# Altium project FPGA_RGB_LED_Matrix.PrjPcb
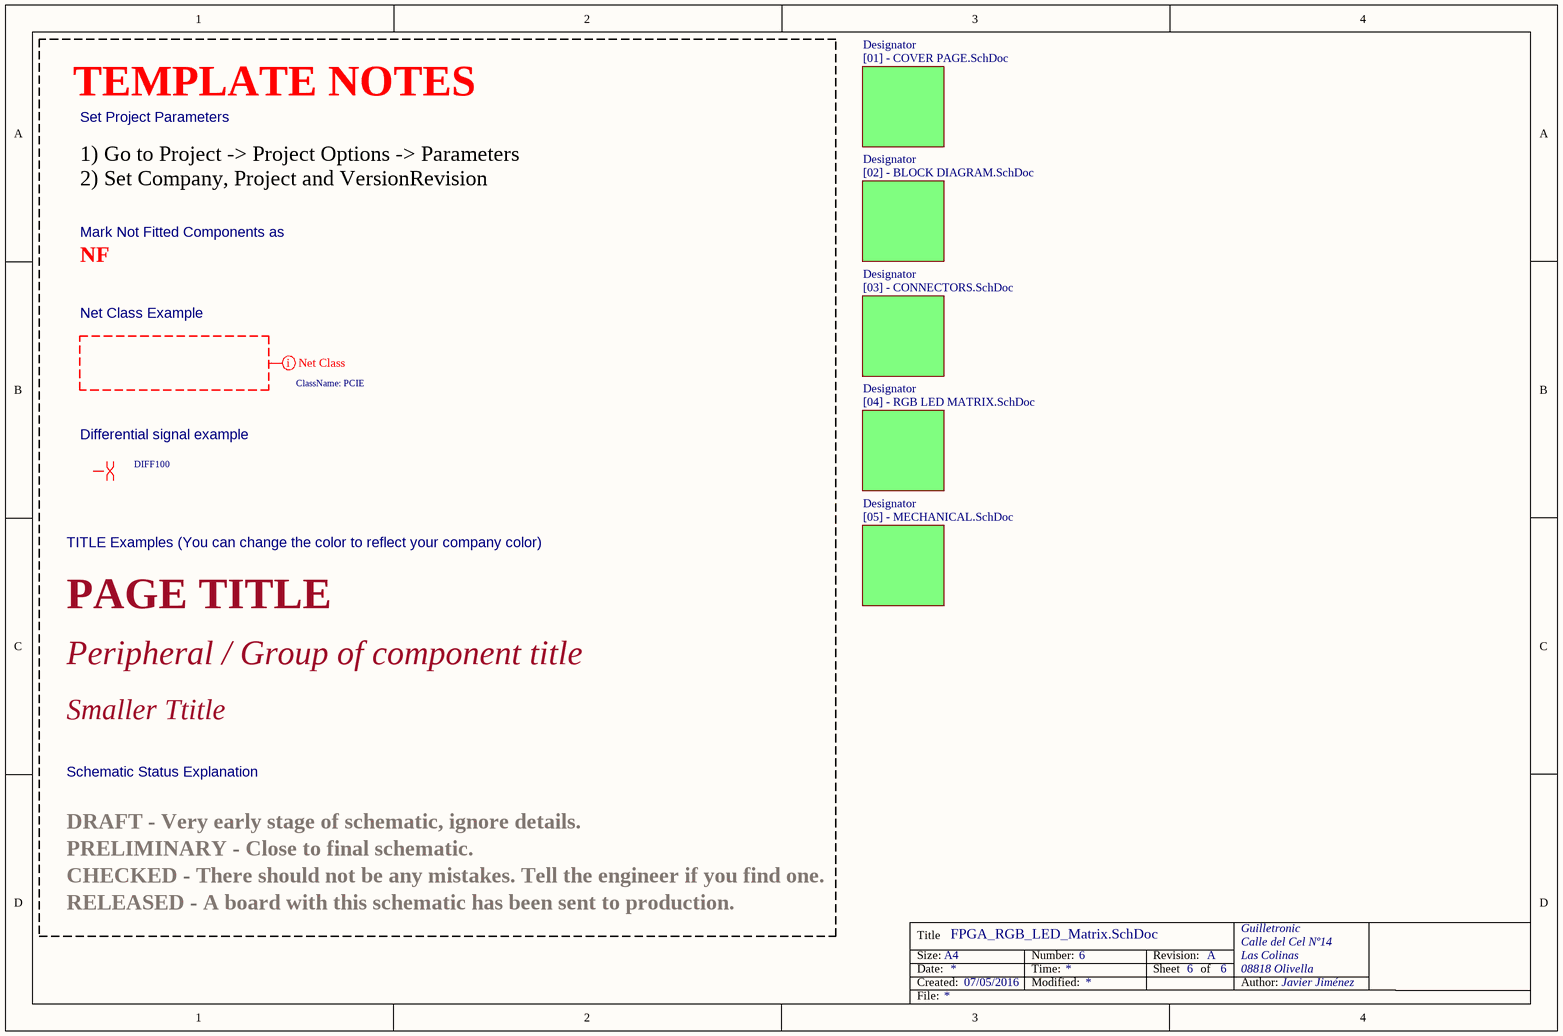
[diagram p0: FPGA_RGB_LED_Matrix.SchDoc]
Project: RGB LED MATRIX; VersionRevision: V1I1
6 sheets, 113 parts. Net scope: global (net labels, ports and power ports of the same name join across sheets).
Board file: RGB_LED MATRIX.PcbDoc
Sheets:
  FPGA_RGB_LED_Matrix.SchDoc
    Designator = [01] - COVER PAGE.SchDoc
    Designator = [02] - BLOCK DIAGRAM.SchDoc
    Designator = [03] - CONNECTORS.SchDoc
    Designator = [04] - RGB LED MATRIX.SchDoc
    Designator = [05] - MECHANICAL.SchDoc

## Sheet FPGA_RGB_LED_Matrix.SchDoc
size A4; Date: 07/05/2016; CheckedBy: Javier Guillemat; Author: Javier Jiménez; CompanyName: Guilletronic; Organization: Guilletronic; Address1: Calle del Cel Nº14; Address2: Las Colinas; Address3: 08818 Olivella; DocumentNumber: 6; Revision: A; SheetNumber: 6; SheetTotal: 6

### Sub-sheets
Designator = [01] - COVER PAGE.SchDoc: no entries
Designator = [02] - BLOCK DIAGRAM.SchDoc: no entries
Designator = [03] - CONNECTORS.SchDoc: no entries
Designator = [04] - RGB LED MATRIX.SchDoc: no entries
Designator = [05] - MECHANICAL.SchDoc: no entries

### Layout directives
net class PCIE: (no net found under the mark)
differential pair; net class DIFF100: (no net found under the mark)

### Notes on the sheet
- TEMPLATE NOTES
- Set Project Parameters
- 1) Go to Project -> Project Options -> Parameters
  2) Set Company, Project and VersionRevision
- Mark Not Fitted Components as
- NF
- Net Class Example
- Differential signal example
- TITLE Examples (You can change the color to reflect your company color)
- PAGE TITLE
- Peripheral / Group of component title
- Schematic Status Explanation
- Smaller Ttitle
- DRAFT - Very early stage of schematic, ignore details.
- PRELIMINARY - Close to final schematic.
- RELEASED - A board with this schematic has been sent to production.
- CHECKED - There should not be any mistakes. Tell the engineer if you find one.
- Title
- Size:
- Date:
- Created:
- A4
- Number:
- Time:
- Modified:
- Revision:
- Sheet
- of
- Author:
- File:

## Sheet [01] - COVER PAGE.SchDoc
size A4; Date: 07/05/2016; CheckedBy: Javier Jiménez Pérez; Author: Javier Jiménez; CompanyName: Guilletronic; Engineer: Javier Jiménez Pérez; Organization: Guilletronic; Address1: Calle del Cel Nº14; Address2: Las Colinas; Address3: 08818 Olivella; DocumentNumber: 1; Revision: A; SheetNumber: 1; SheetTotal: 6
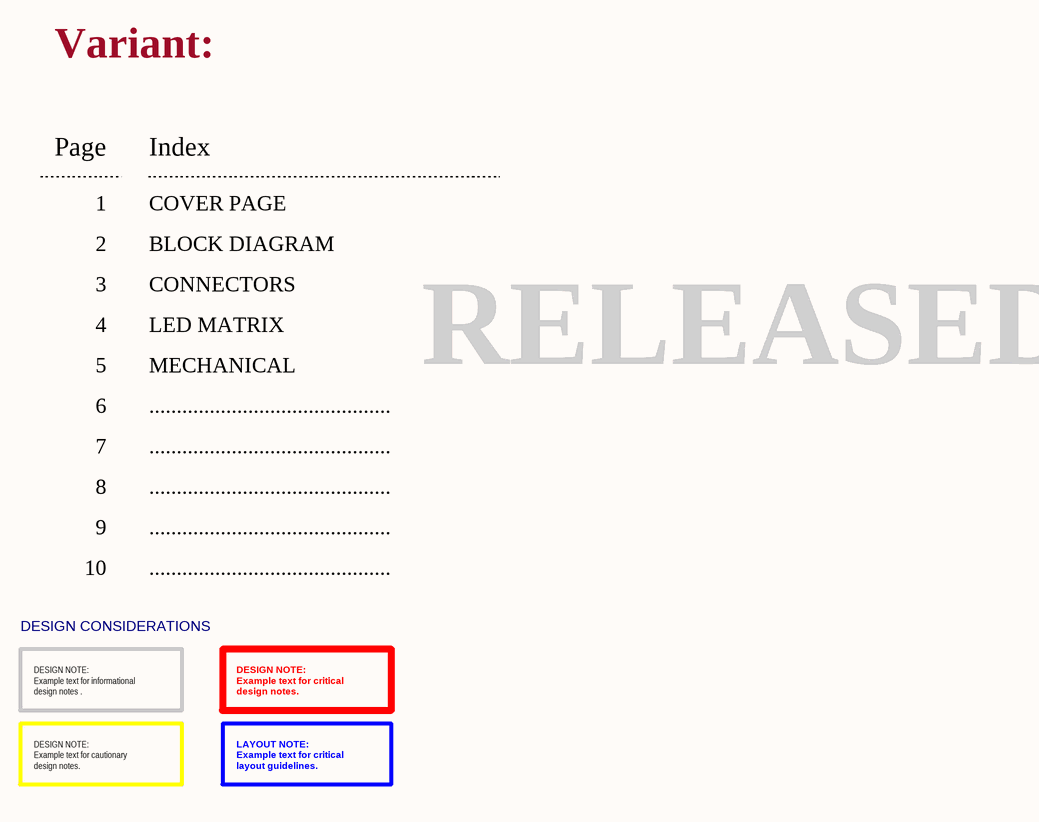
[diagram p1: [01] - COVER PAGE.SchDoc]

### Notes on the sheet
- Variant:
- Page
- Index
- 1
- 2
- COVER PAGE
- BLOCK DIAGRAM
- 3
- 4
- CONNECTORS
- LED MATRIX
- 5
- MECHANICAL
- RELEASED
- 6
- 7
- ............................................
- 8
- 9
- 10
- DESIGN CONSIDERATIONS
- DESIGN NOTE:
  Example text for informational
  design notes .
- DESIGN NOTE:
  Example text for critical
  design notes.
- DESIGN NOTE:
  Example text for cautionary
  design notes.
- LAYOUT NOTE:
  Example text for critical
  layout guidelines.
- Title
- Size:
- Date:
- Created:
- A4
- Number:
- Time:
- Modified:
- Revision:
- Sheet
- of
- Author:
- File:

## Sheet [02] - BLOCK DIAGRAM.SchDoc
size A4; Date: 07/05/2016; CheckedBy: Javier Jiménez Pérez; Author: Javier Jiménez; CompanyName: Guilletronic; Organization: Guilletronic; Address1: Calle del Cel Nº14; Address2: Las Colinas; Address3: 08818 Olivella; DocumentNumber: 2; Revision: A; SheetNumber: 2; SheetTotal: 6
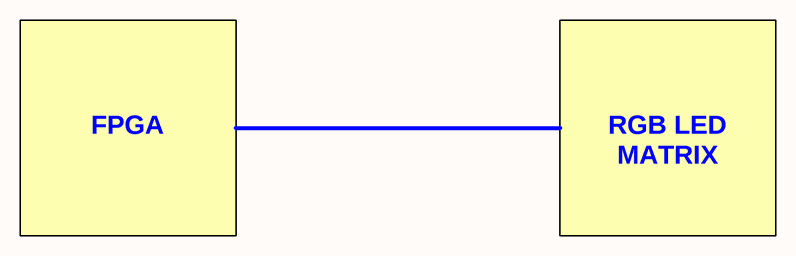
[diagram p2: [02] - BLOCK DIAGRAM.SchDoc]

### Notes on the sheet
- FPGA
- RGB LED MATRIX
- Title
- Size:
- Date:
- Created:
- A4
- Number:
- Time:
- Modified:
- Revision:
- Sheet
- of
- Author:
- File:

## Sheet [03] - CONNECTORS.SchDoc
size A4; Date: 07/05/2016; CheckedBy: Javier Guillemat; Author: Javier Jiménez; CompanyName: Guilletronic; Organization: Guilletronic; Address1: Calle del Cel Nº14; Address2: Las Colinas; Address3: 08818 Olivella; DocumentNumber: 3; Revision: A; SheetNumber: 3; SheetTotal: 6
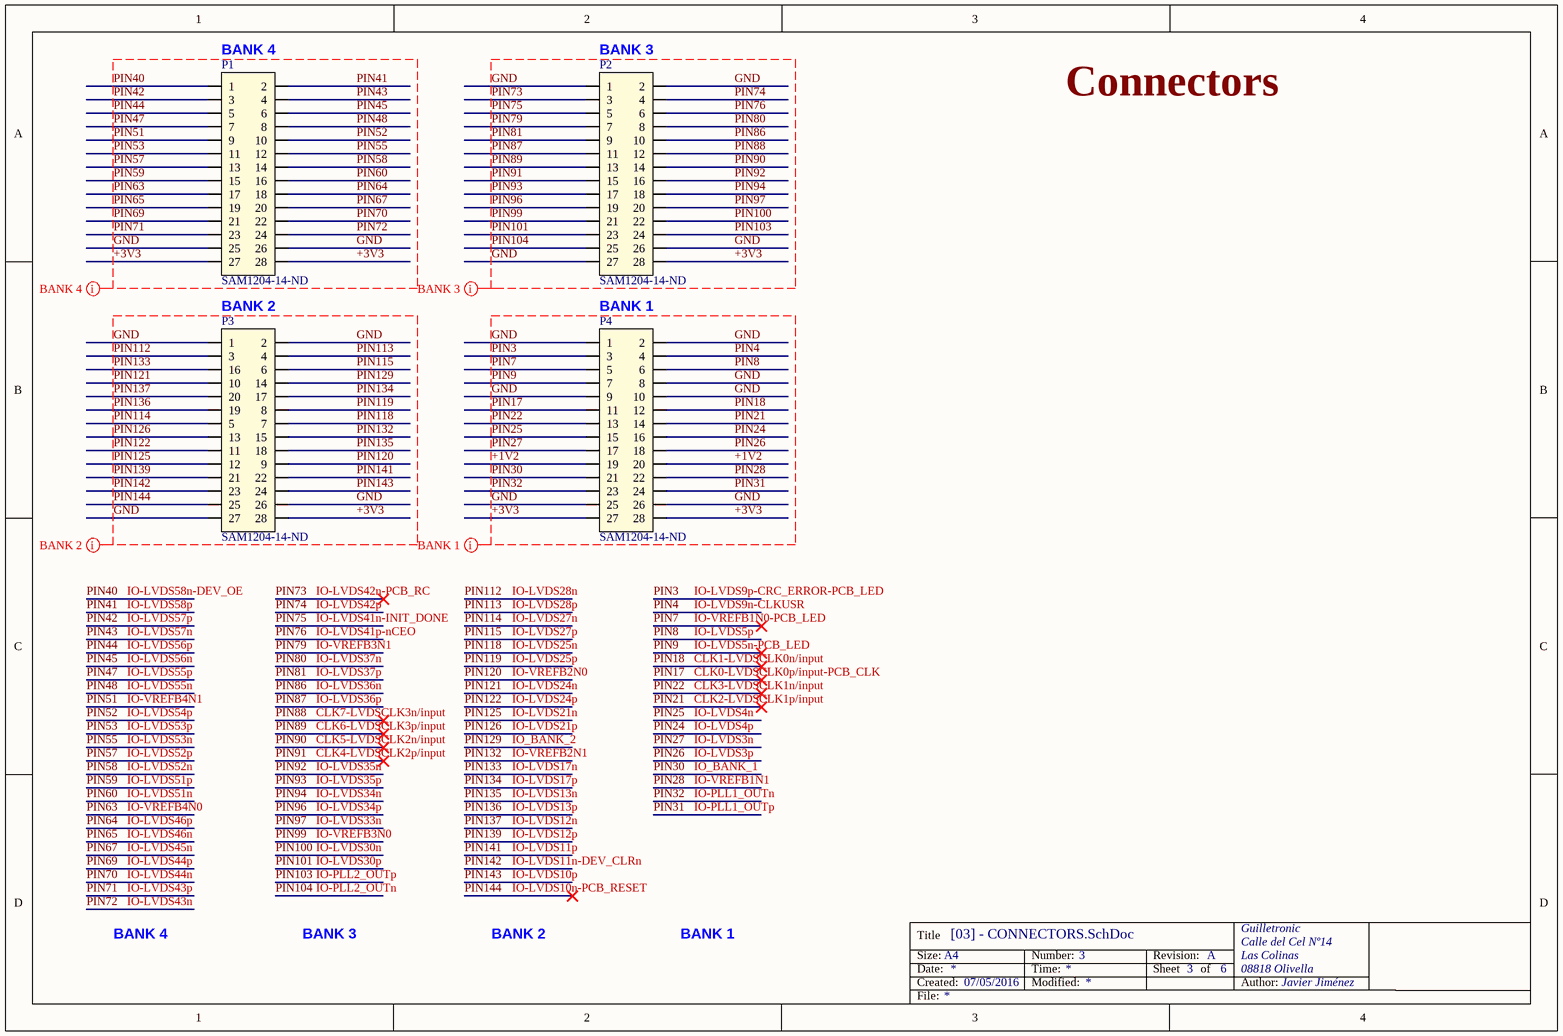
[diagram p3: [03] - CONNECTORS.SchDoc]

### Parts
P1  Supplier Part Number 1: SAM1204-14-ND  [Female Header 14x2 2.54mm 10mm]  (hidden comment: Female Header 14x2 2.54mm 10mm)
P2  Supplier Part Number 1: SAM1204-14-ND  [Female Header 14x2 2.54mm 10mm]  (hidden comment: Female Header 14x2 2.54mm 10mm)
P3  Supplier Part Number 1: SAM1204-14-ND  [Female Header 14x2 2.54mm 10mm]  (hidden comment: Female Header 14x2 2.54mm 10mm)
P4  Supplier Part Number 1: SAM1204-14-ND  [Female Header 14x2 2.54mm 10mm]  (hidden comment: Female Header 14x2 2.54mm 10mm)

### Nets
+1V2: P4.19 P4.20
+3V3: P1.27 P1.28 P2.28 P3.28 P4.27 P4.28
GND: P1.25 P1.26 P2.1 P2.2 P2.26 P2.27 P3.1 P3.2 P3.26 P3.27 P4.1 P4.2 P4.8 P4.9 P4.10 P4.25 P4.26
PIN3: P4.3
PIN4: P4.4
PIN7: P4.5
PIN8: P4.6
PIN9: P4.7
PIN17: P4.11
PIN18: P4.12
PIN21: P4.14
PIN22: P4.13
PIN24: P4.16
PIN25: P4.15
PIN26: P4.18
PIN27: P4.17
PIN28: P4.22
PIN30: P4.21
PIN31: P4.24
PIN32: P4.23
PIN40: P1.1
PIN41: P1.2
PIN42: P1.3
PIN43: P1.4
PIN44: P1.5
PIN45: P1.6
PIN47: P1.7
PIN48: P1.8
PIN51: P1.9
PIN52: P1.10
PIN53: P1.11
PIN55: P1.12
PIN57: P1.13
PIN58: P1.14
PIN59: P1.15
PIN60: P1.16
PIN63: P1.17
PIN64: P1.18
PIN65: P1.19
PIN67: P1.20
PIN69: P1.21
PIN70: P1.22
PIN71: P1.23
PIN72: P1.24
PIN73: P2.3
PIN74: P2.4
PIN75: P2.5
PIN76: P2.6
PIN79: P2.7
PIN80: P2.8
PIN81: P2.9
PIN86: P2.10
PIN87: P2.11
PIN88: P2.12
PIN89: P2.13
PIN90: P2.14
PIN91: P2.15
PIN92: P2.16
PIN93: P2.17
PIN94: P2.18
PIN96: P2.19
PIN97: P2.20
PIN99: P2.21
PIN100: P2.22
PIN101: P2.23
PIN103: P2.24
PIN104: P2.25
PIN112: P3.3
PIN113: P3.4
PIN114: P3.5
PIN115: P3.6
PIN118: P3.7
PIN119: P3.8
PIN120: P3.9
PIN121: P3.10
PIN122: P3.11
PIN125: P3.12
PIN126: P3.13
PIN129: P3.14
PIN132: P3.15
PIN133: P3.16
PIN134: P3.17
PIN135: P3.18
PIN136: P3.19
PIN137: P3.20
PIN139: P3.21
PIN141: P3.22
PIN142: P3.23
PIN143: P3.24
PIN144: P3.25

### Layout directives
net class BANK 2: +3V3, GND, PIN112, PIN113, PIN114, PIN115, PIN118, PIN119, PIN120, PIN121, PIN122, PIN125, PIN126, PIN129, PIN132, PIN133, PIN134, PIN135, PIN136, PIN137, PIN139, PIN141, PIN142, PIN143, PIN144
net class BANK 3: +3V3, GND, PIN73, PIN74, PIN75, PIN76, PIN79, PIN80, PIN81, PIN86, PIN87, PIN88, PIN89, PIN90, PIN91, PIN92, PIN93, PIN94, PIN96, PIN97, PIN99, PIN100, PIN101, PIN103, PIN104
net class BANK 4: +3V3, GND, PIN40, PIN41, PIN42, PIN43, PIN44, PIN45, PIN47, PIN48, PIN51, PIN52, PIN53, PIN55, PIN57, PIN58, PIN59, PIN60, PIN63, PIN64, PIN65, PIN67, PIN69, PIN70, PIN71, PIN72
net class BANK 1: +1V2, +3V3, GND, PIN3, PIN4, PIN7, PIN8, PIN9, PIN17, PIN18, PIN21, PIN22, PIN24, PIN25, PIN26, PIN27, PIN28, PIN30, PIN31, PIN32

### Notes on the sheet
- (near P1) BANK 4
- (near P2) BANK 3
- Connectors
- BANK 2
- BANK 1
- IO-LVDS58n-DEV_OE
- IO-LVDS58p
- IO-LVDS57p
- IO-LVDS57n
- IO-LVDS56p
- IO-LVDS42n-PCB_RC
- IO-LVDS42p
- IO-LVDS41n-INIT_DONE
- IO-LVDS41p-nCEO
- IO-VREFB3N1
- IO-LVDS28n
- IO-LVDS28p
- IO-LVDS27n
- IO-LVDS27p
- IO-LVDS25n
- IO-LVDS9p-CRC_ERROR-PCB_LED
- IO-LVDS9n-CLKUSR
- IO-VREFB1N0-PCB_LED
- IO-LVDS5p
- IO-LVDS5n-PCB_LED
- IO-LVDS56n
- IO-LVDS55p
- IO-LVDS55n
- IO-VREFB4N1
- IO-LVDS54p
- IO-LVDS37n
- IO-LVDS37p
- IO-LVDS36n
- IO-LVDS36p
- CLK7-LVDSCLK3n/input
- IO-LVDS25p
- IO-VREFB2N0
- IO-LVDS24n
- IO-LVDS24p
- IO-LVDS21n
- CLK1-LVDSCLK0n/input
- CLK0-LVDSCLK0p/input-PCB_CLK
- CLK3-LVDSCLK1n/input
- CLK2-LVDSCLK1p/input
- IO-LVDS4n
- IO-LVDS53p
- IO-LVDS53n
- IO-LVDS52p
- IO-LVDS52n
- IO-LVDS51p
- CLK6-LVDSCLK3p/input
- CLK5-LVDSCLK2n/input
- CLK4-LVDSCLK2p/input
- IO-LVDS35n
- IO-LVDS35p
- IO-LVDS21p
- IO_BANK_2
- IO-VREFB2N1
- IO-LVDS17n
- IO-LVDS17p
- IO-LVDS4p
- IO-LVDS3n
- IO-LVDS3p
- IO_BANK_1
- IO-VREFB1N1
- IO-LVDS51n
- IO-VREFB4N0
- IO-LVDS46p
- IO-LVDS46n
- IO-LVDS45n
- IO-LVDS34n
- IO-LVDS34p
- IO-LVDS33n
- IO-VREFB3N0
- IO-LVDS30n
- IO-LVDS13n
- IO-LVDS13p
- IO-LVDS12n
- IO-LVDS12p
- IO-LVDS11p
- IO-PLL1_OUTn
- IO-PLL1_OUTp
- IO-LVDS44p
- IO-LVDS44n
- IO-LVDS43p
- IO-LVDS43n
- IO-LVDS30p
- IO-PLL2_OUTp
- IO-PLL2_OUTn
- IO-LVDS11n-DEV_CLRn
- IO-LVDS10p
- IO-LVDS10n-PCB_RESET
- BANK 4
- BANK 3
- Title
- Size:
- Date:
- Created:
- A4
- Number:
- Time:
- Modified:
- Revision:
- Sheet
- of
- Author:
- File:

### Library data of the parts
P1-P4 = Female Header 14x2 2.54mm 10mm: ELEVATED SOCKET STRIPS; Style: Board to Board; Number of Positions: 14; Number of Positions Loaded: All; Pitch - Mating: 0.100" (2.54mm); Contact Length - Post: 0.090" (2.29mm); Material Flammability Rating: UL94 V-0; Current Rating: 5.7A per Contact; Voltage Rating: 550VAC; Description 2: CONN HEADER FMAL 28PS .1" DL TIN; Category 2: Connectors, Interconnects; RoHS: RoHS Compliant; Packaging: Tube; Part Status: Active; Connector Type: Elevated Socket; Contact Type: Forked; Number of Rows: 2; Row Spacing - Mating: 0.100" (2.54mm); Mounting Type: Through Hole; Termination: Solder; Fastening Type: Push-Pull; Contact Finish - Mating: Gold; Contact Finish Thickness - Mating: 20µin (0.51µm); Insulation Color: Black; Insulation Height: 0.435" (11.05mm); Operating Temperature: -55°C ~ 125°C; Contact Finish - Post: Gold; Mated Stacking Heights: -; Ingress Protection: -; Features: -; Applications: -; Insulation Material: Liquid Crystal Polymer (LCP); Contact Shape: Square; Contact Material: Phosphor Bronze; Contact Finish Thickness - Post: 3µin (0.08µm); ComponentLink1URL: http://suddendocs.samtec.com/prints/esq-1xx-xx-x-x-xxx-xx-x-xx-mkt.pdf; ComponentLink1Description: http://suddendocs.samtec.com/prints/esq-1xx-xx-x-x-xxx-xx-x-xx-mkt.pdf; ComponentLink2URL: http://www.sullinscorp.com/drawings/78_P(N)PxCxxxLFBN-RC,_10492-H.pdf; ComponentLink2Description: http://www.sullinscorp.com/drawings/78_P(N)PxCxxxLFBN-RC,_10492-H.pdf; Supplier 1: Digi-Key; Manufacturer 2: Sullins Connector Solutions; Manufacturer Part Number 2: PPTC142LFBN-RC; Stock 2: 1937; Pricing 2: 1=1.92, 10=1.586, 25=1.4868, 50=1.3216, 100=1.1894, 250=1.09692, 500=0.9912, 1000=0.87886, 2500=0.84252 (EUR)

## Sheet [04] - RGB LED MATRIX.SchDoc
size A4; Date: 07/05/2016; CheckedBy: Javier Guillemat; Author: Javier Jiménez; CompanyName: Guilletronic; Organization: Guilletronic; Address1: Calle del Cel Nº14; Address2: Las Colinas; Address3: 08818 Olivella; DocumentNumber: 4; Revision: A; SheetNumber: 4; SheetTotal: 6
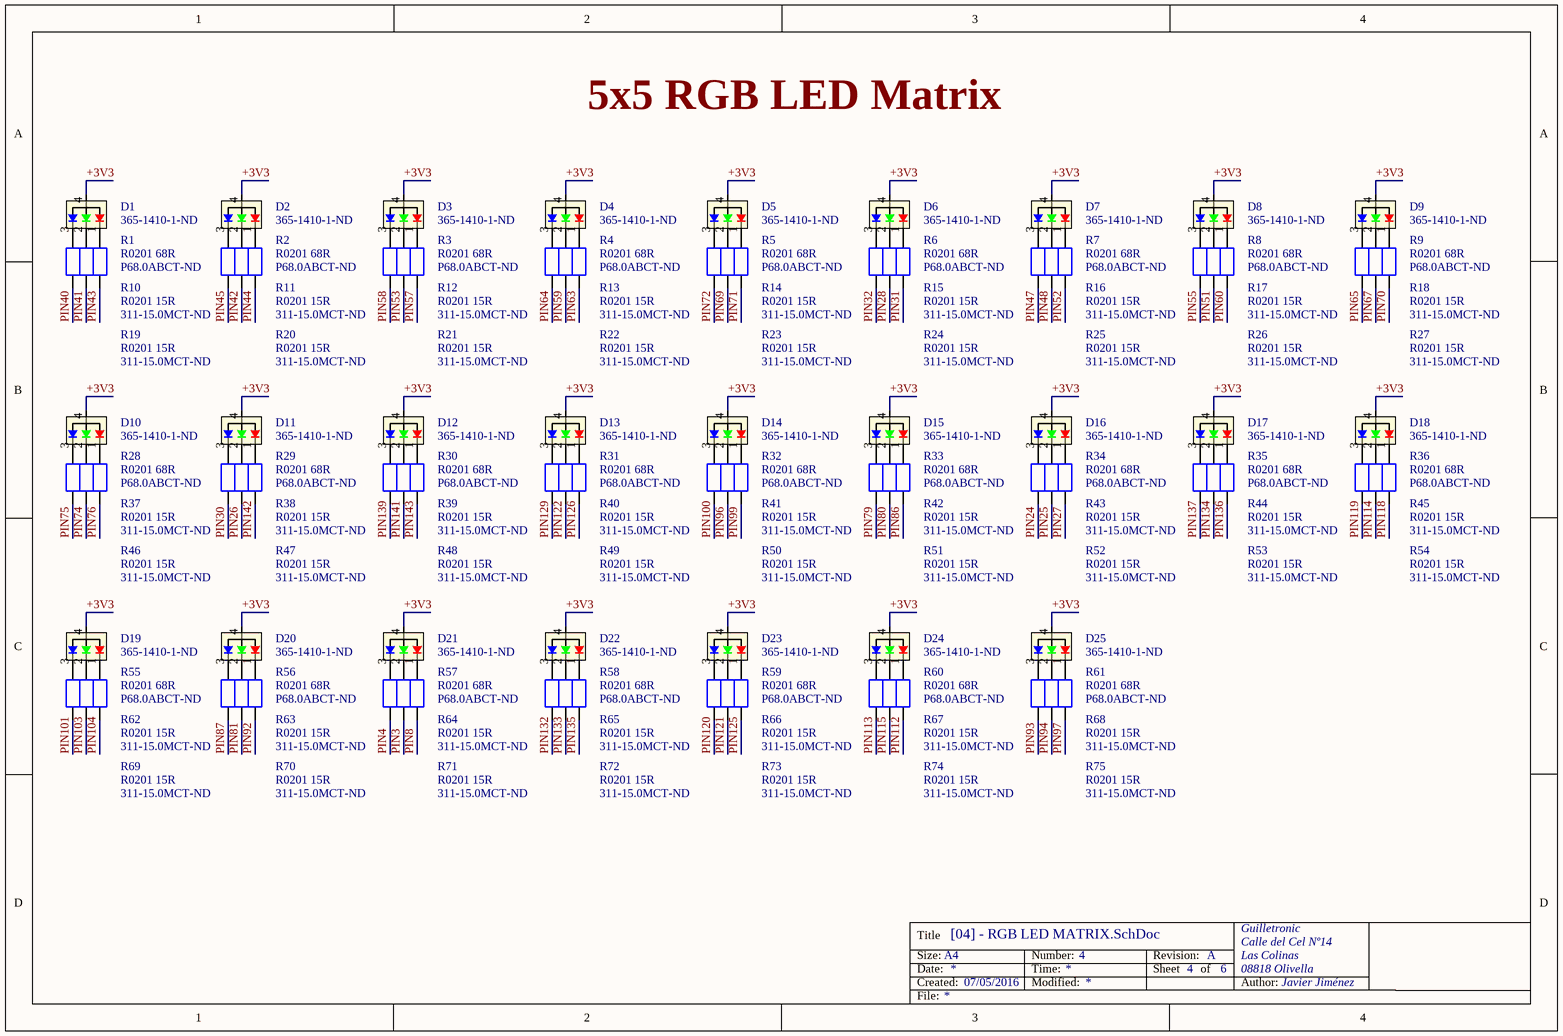
[diagram p4: [04] - RGB LED MATRIX.SchDoc]

### Parts
D1  Supplier Part Number 1: 365-1410-1-ND  [LED RGB]  (hidden comment: LED RGB)
D2  Supplier Part Number 1: 365-1410-1-ND  [LED RGB]  (hidden comment: LED RGB)
D3  Supplier Part Number 1: 365-1410-1-ND  [LED RGB]  (hidden comment: LED RGB)
D4  Supplier Part Number 1: 365-1410-1-ND  [LED RGB]  (hidden comment: LED RGB)
D5  Supplier Part Number 1: 365-1410-1-ND  [LED RGB]  (hidden comment: LED RGB)
D6  Supplier Part Number 1: 365-1410-1-ND  [LED RGB]  (hidden comment: LED RGB)
D7  Supplier Part Number 1: 365-1410-1-ND  [LED RGB]  (hidden comment: LED RGB)
D8  Supplier Part Number 1: 365-1410-1-ND  [LED RGB]  (hidden comment: LED RGB)
D9  Supplier Part Number 1: 365-1410-1-ND  [LED RGB]  (hidden comment: LED RGB)
D10  Supplier Part Number 1: 365-1410-1-ND  [LED RGB]  (hidden comment: LED RGB)
D11  Supplier Part Number 1: 365-1410-1-ND  [LED RGB]  (hidden comment: LED RGB)
D12  Supplier Part Number 1: 365-1410-1-ND  [LED RGB]  (hidden comment: LED RGB)
D13  Supplier Part Number 1: 365-1410-1-ND  [LED RGB]  (hidden comment: LED RGB)
D14  Supplier Part Number 1: 365-1410-1-ND  [LED RGB]  (hidden comment: LED RGB)
D15  Supplier Part Number 1: 365-1410-1-ND  [LED RGB]  (hidden comment: LED RGB)
D16  Supplier Part Number 1: 365-1410-1-ND  [LED RGB]  (hidden comment: LED RGB)
D17  Supplier Part Number 1: 365-1410-1-ND  [LED RGB]  (hidden comment: LED RGB)
D18  Supplier Part Number 1: 365-1410-1-ND  [LED RGB]  (hidden comment: LED RGB)
D19  Supplier Part Number 1: 365-1410-1-ND  [LED RGB]  (hidden comment: LED RGB)
D20  Supplier Part Number 1: 365-1410-1-ND  [LED RGB]  (hidden comment: LED RGB)
D21  Supplier Part Number 1: 365-1410-1-ND  [LED RGB]  (hidden comment: LED RGB)
D22  Supplier Part Number 1: 365-1410-1-ND  [LED RGB]  (hidden comment: LED RGB)
D23  Supplier Part Number 1: 365-1410-1-ND  [LED RGB]  (hidden comment: LED RGB)
D24  Supplier Part Number 1: 365-1410-1-ND  [LED RGB]  (hidden comment: LED RGB)
D25  Supplier Part Number 1: 365-1410-1-ND  [LED RGB]  (hidden comment: LED RGB)
R1  R0201 68R  Supplier Part Number 1: P68.0ABCT-ND  [R0201]
R2  R0201 68R  Supplier Part Number 1: P68.0ABCT-ND  [R0201]
R3  R0201 68R  Supplier Part Number 1: P68.0ABCT-ND  [R0201]
R4  R0201 68R  Supplier Part Number 1: P68.0ABCT-ND  [R0201]
R5  R0201 68R  Supplier Part Number 1: P68.0ABCT-ND  [R0201]
R6  R0201 68R  Supplier Part Number 1: P68.0ABCT-ND  [R0201]
R7  R0201 68R  Supplier Part Number 1: P68.0ABCT-ND  [R0201]
R8  R0201 68R  Supplier Part Number 1: P68.0ABCT-ND  [R0201]
R9  R0201 68R  Supplier Part Number 1: P68.0ABCT-ND  [R0201]
R10  R0201 15R  Supplier Part Number 1: 311-15.0MCT-ND  [R0201]
R11  R0201 15R  Supplier Part Number 1: 311-15.0MCT-ND  [R0201]
R12  R0201 15R  Supplier Part Number 1: 311-15.0MCT-ND  [R0201]
R13  R0201 15R  Supplier Part Number 1: 311-15.0MCT-ND  [R0201]
R14  R0201 15R  Supplier Part Number 1: 311-15.0MCT-ND  [R0201]
R15  R0201 15R  Supplier Part Number 1: 311-15.0MCT-ND  [R0201]
R16  R0201 15R  Supplier Part Number 1: 311-15.0MCT-ND  [R0201]
R17  R0201 15R  Supplier Part Number 1: 311-15.0MCT-ND  [R0201]
R18  R0201 15R  Supplier Part Number 1: 311-15.0MCT-ND  [R0201]
R19  R0201 15R  Supplier Part Number 1: 311-15.0MCT-ND  [R0201]
R20  R0201 15R  Supplier Part Number 1: 311-15.0MCT-ND  [R0201]
R21  R0201 15R  Supplier Part Number 1: 311-15.0MCT-ND  [R0201]
R22  R0201 15R  Supplier Part Number 1: 311-15.0MCT-ND  [R0201]
R23  R0201 15R  Supplier Part Number 1: 311-15.0MCT-ND  [R0201]
R24  R0201 15R  Supplier Part Number 1: 311-15.0MCT-ND  [R0201]
R25  R0201 15R  Supplier Part Number 1: 311-15.0MCT-ND  [R0201]
R26  R0201 15R  Supplier Part Number 1: 311-15.0MCT-ND  [R0201]
R27  R0201 15R  Supplier Part Number 1: 311-15.0MCT-ND  [R0201]
R28  R0201 68R  Supplier Part Number 1: P68.0ABCT-ND  [R0201]
R29  R0201 68R  Supplier Part Number 1: P68.0ABCT-ND  [R0201]
R30  R0201 68R  Supplier Part Number 1: P68.0ABCT-ND  [R0201]
R31  R0201 68R  Supplier Part Number 1: P68.0ABCT-ND  [R0201]
R32  R0201 68R  Supplier Part Number 1: P68.0ABCT-ND  [R0201]
R33  R0201 68R  Supplier Part Number 1: P68.0ABCT-ND  [R0201]
R34  R0201 68R  Supplier Part Number 1: P68.0ABCT-ND  [R0201]
R35  R0201 68R  Supplier Part Number 1: P68.0ABCT-ND  [R0201]
R36  R0201 68R  Supplier Part Number 1: P68.0ABCT-ND  [R0201]
R37  R0201 15R  Supplier Part Number 1: 311-15.0MCT-ND  [R0201]
R38  R0201 15R  Supplier Part Number 1: 311-15.0MCT-ND  [R0201]
R39  R0201 15R  Supplier Part Number 1: 311-15.0MCT-ND  [R0201]
R40  R0201 15R  Supplier Part Number 1: 311-15.0MCT-ND  [R0201]
R41  R0201 15R  Supplier Part Number 1: 311-15.0MCT-ND  [R0201]
R42  R0201 15R  Supplier Part Number 1: 311-15.0MCT-ND  [R0201]
R43  R0201 15R  Supplier Part Number 1: 311-15.0MCT-ND  [R0201]
R44  R0201 15R  Supplier Part Number 1: 311-15.0MCT-ND  [R0201]
R45  R0201 15R  Supplier Part Number 1: 311-15.0MCT-ND  [R0201]
R46  R0201 15R  Supplier Part Number 1: 311-15.0MCT-ND  [R0201]
R47  R0201 15R  Supplier Part Number 1: 311-15.0MCT-ND  [R0201]
R48  R0201 15R  Supplier Part Number 1: 311-15.0MCT-ND  [R0201]
R49  R0201 15R  Supplier Part Number 1: 311-15.0MCT-ND  [R0201]
R50  R0201 15R  Supplier Part Number 1: 311-15.0MCT-ND  [R0201]
R51  R0201 15R  Supplier Part Number 1: 311-15.0MCT-ND  [R0201]
R52  R0201 15R  Supplier Part Number 1: 311-15.0MCT-ND  [R0201]
R53  R0201 15R  Supplier Part Number 1: 311-15.0MCT-ND  [R0201]
R54  R0201 15R  Supplier Part Number 1: 311-15.0MCT-ND  [R0201]
R55  R0201 68R  Supplier Part Number 1: P68.0ABCT-ND  [R0201]
R56  R0201 68R  Supplier Part Number 1: P68.0ABCT-ND  [R0201]
R57  R0201 68R  Supplier Part Number 1: P68.0ABCT-ND  [R0201]
R58  R0201 68R  Supplier Part Number 1: P68.0ABCT-ND  [R0201]
R59  R0201 68R  Supplier Part Number 1: P68.0ABCT-ND  [R0201]
R60  R0201 68R  Supplier Part Number 1: P68.0ABCT-ND  [R0201]
R61  R0201 68R  Supplier Part Number 1: P68.0ABCT-ND  [R0201]
R62  R0201 15R  Supplier Part Number 1: 311-15.0MCT-ND  [R0201]
R63  R0201 15R  Supplier Part Number 1: 311-15.0MCT-ND  [R0201]
R64  R0201 15R  Supplier Part Number 1: 311-15.0MCT-ND  [R0201]
R65  R0201 15R  Supplier Part Number 1: 311-15.0MCT-ND  [R0201]
R66  R0201 15R  Supplier Part Number 1: 311-15.0MCT-ND  [R0201]
R67  R0201 15R  Supplier Part Number 1: 311-15.0MCT-ND  [R0201]
R68  R0201 15R  Supplier Part Number 1: 311-15.0MCT-ND  [R0201]
R69  R0201 15R  Supplier Part Number 1: 311-15.0MCT-ND  [R0201]
R70  R0201 15R  Supplier Part Number 1: 311-15.0MCT-ND  [R0201]
R71  R0201 15R  Supplier Part Number 1: 311-15.0MCT-ND  [R0201]
R72  R0201 15R  Supplier Part Number 1: 311-15.0MCT-ND  [R0201]
R73  R0201 15R  Supplier Part Number 1: 311-15.0MCT-ND  [R0201]
R74  R0201 15R  Supplier Part Number 1: 311-15.0MCT-ND  [R0201]
R75  R0201 15R  Supplier Part Number 1: 311-15.0MCT-ND  [R0201]

### Nets
+3V3: D1.4(ANODE) D2.4(ANODE) D3.4(ANODE) D4.4(ANODE) D5.4(ANODE) D6.4(ANODE) D7.4(ANODE) D8.4(ANODE) D9.4(ANODE) D10.4(ANODE) D11.4(ANODE) D12.4(ANODE) D13.4(ANODE) D14.4(ANODE) D15.4(ANODE) D16.4(ANODE) D17.4(ANODE) D18.4(ANODE) D19.4(ANODE) D20.4(ANODE) D21.4(ANODE) D22.4(ANODE) D23.4(ANODE) D24.4(ANODE) D25.4(ANODE)
PIN3: R64.2
PIN4: R71.2
PIN8: R57.2
PIN24: R52.2
PIN25: R43.2
PIN26: R38.2
PIN27: R34.2
PIN28: R15.2
PIN30: R47.2
PIN31: R6.2
PIN32: R24.2
PIN40: R19.2
PIN41: R10.2
PIN42: R11.2
PIN43: R1.2
PIN44: R2.2
PIN45: R20.2
PIN47: R25.2
PIN48: R16.2
PIN51: R17.2
PIN52: R7.2
PIN53: R12.2
PIN55: R26.2
PIN57: R3.2
PIN58: R21.2
PIN59: R13.2
PIN60: R8.2
PIN63: R4.2
PIN64: R22.2
PIN65: R27.2
PIN67: R18.2
PIN69: R14.2
PIN70: R9.2
PIN71: R5.2
PIN72: R23.2
PIN74: R37.2
PIN75: R46.2
PIN76: R28.2
PIN79: R51.2
PIN80: R42.2
PIN81: R63.2
PIN86: R33.2
PIN87: R70.2
PIN92: R56.2
PIN93: R75.2
PIN94: R68.2
PIN96: R41.2
PIN97: R61.2
PIN99: R32.2
PIN100: R50.2
PIN101: R69.2
PIN103: R62.2
PIN104: R55.2
PIN112: R60.2
PIN113: R74.2
PIN114: R45.2
PIN115: R67.2
PIN118: R36.2
PIN119: R54.2
PIN120: R73.2
PIN121: R66.2
PIN122: R40.2
PIN125: R59.2
PIN126: R31.2
PIN129: R49.2
PIN132: R72.2
PIN133: R65.2
PIN134: R44.2
PIN135: R58.2
PIN136: R35.2
PIN137: R53.2
PIN139: R48.2
PIN141: R39.2
PIN142: R29.2
PIN143: R30.2
NetD1_1: D1.1(R) R1.1
NetD1_2: D1.2(G) R10.1
NetD1_3: D1.3(B) R19.1
NetD2_1: D2.1(R) R2.1
NetD2_2: D2.2(G) R11.1
NetD2_3: D2.3(B) R20.1
NetD3_1: D3.1(R) R3.1
NetD3_2: D3.2(G) R12.1
NetD3_3: D3.3(B) R21.1
NetD4_1: D4.1(R) R4.1
NetD4_2: D4.2(G) R13.1
NetD4_3: D4.3(B) R22.1
NetD5_1: D5.1(R) R5.1
NetD5_2: D5.2(G) R14.1
NetD5_3: D5.3(B) R23.1
NetD6_1: D6.1(R) R6.1
NetD6_2: D6.2(G) R15.1
NetD6_3: D6.3(B) R24.1
NetD7_1: D7.1(R) R7.1
NetD7_2: D7.2(G) R16.1
NetD7_3: D7.3(B) R25.1
NetD8_1: D8.1(R) R8.1
NetD8_2: D8.2(G) R17.1
NetD8_3: D8.3(B) R26.1
NetD9_1: D9.1(R) R9.1
NetD9_2: D9.2(G) R18.1
NetD9_3: D9.3(B) R27.1
NetD10_1: D10.1(R) R28.1
NetD10_2: D10.2(G) R37.1
NetD10_3: D10.3(B) R46.1
NetD11_1: D11.1(R) R29.1
NetD11_2: D11.2(G) R38.1
NetD11_3: D11.3(B) R47.1
NetD12_1: D12.1(R) R30.1
NetD12_2: D12.2(G) R39.1
NetD12_3: D12.3(B) R48.1
NetD13_1: D13.1(R) R31.1
NetD13_2: D13.2(G) R40.1
NetD13_3: D13.3(B) R49.1
NetD14_1: D14.1(R) R32.1
NetD14_2: D14.2(G) R41.1
NetD14_3: D14.3(B) R50.1
NetD15_1: D15.1(R) R33.1
NetD15_2: D15.2(G) R42.1
NetD15_3: D15.3(B) R51.1
NetD16_1: D16.1(R) R34.1
NetD16_2: D16.2(G) R43.1
NetD16_3: D16.3(B) R52.1
NetD17_1: D17.1(R) R35.1
NetD17_2: D17.2(G) R44.1
NetD17_3: D17.3(B) R53.1
NetD18_1: D18.1(R) R36.1
NetD18_2: D18.2(G) R45.1
NetD18_3: D18.3(B) R54.1
NetD19_1: D19.1(R) R55.1
NetD19_2: D19.2(G) R62.1
NetD19_3: D19.3(B) R69.1
NetD20_1: D20.1(R) R56.1
NetD20_2: D20.2(G) R63.1
NetD20_3: D20.3(B) R70.1
NetD21_1: D21.1(R) R57.1
NetD21_2: D21.2(G) R64.1
NetD21_3: D21.3(B) R71.1
NetD22_1: D22.1(R) R58.1
NetD22_2: D22.2(G) R65.1
NetD22_3: D22.3(B) R72.1
NetD23_1: D23.1(R) R59.1
NetD23_2: D23.2(G) R66.1
NetD23_3: D23.3(B) R73.1
NetD24_1: D24.1(R) R60.1
NetD24_2: D24.2(G) R67.1
NetD24_3: D24.3(B) R74.1
NetD25_1: D25.1(R) R61.1
NetD25_2: D25.2(G) R68.1
NetD25_3: D25.3(B) R75.1

### Notes on the sheet
- 5x5 RGB LED Matrix
- Title
- Size:
- Date:
- Created:
- A4
- Number:
- Time:
- Modified:
- Revision:
- Sheet
- of
- Author:
- File:

### Library data of the parts
D1-D25 = LED RGB: LED RGB DIFFUSED 4SMD R/A; Supplier 1: Digi-Key
R1-R9 R28-R36 R55-R61 = R0201 68R: Manufacturer 1: Panasonic Electronic Components; Manufacturer Part Number 1: ERJ-1GEF68R0C; Resistance (Ohms): 68; Tolerance: ±1%; Power (Watts): 0.05W, 1/20W; Temperature Coefficient: ±200ppm/°C; Description 1: RES SMD 68 OHM 1% 1/20W 0201; Category 1: Resistors; Supplier 1: Digi-Key; RoHS: RoHS Compliant; Stock 1: 123824; Pricing 1: 1=0.09, 10=0.049, 25=0.036, 50=0.0272, 100=0.02, 250=0.01528, 500=0.01224, 1000=0.00901, 5000=0.00646 (EUR); Packaging: Cut Tape (CT); Part Status: Active; Composition: Thick Film; Features: -; Operating Temperature: -55°C ~ 125°C; Package / Case: 0201 (0603 Metric); Supplier Device Package: 0201; Size / Dimension: 0.024" L x 0.012" W (0.60mm x 0.30mm); Height - Seated (Max): 0.010" (0.26mm); Failure Rate: -; ComponentLink1URL: http://media.digikey.com/pdf/Data%20Sheets/Panasonic%20Resistors%20Thermistors%20PDFs/ERJ_G,R,E_Rev08.pdf; ComponentLink1Description: http://media.digikey.com/pdf/Data%20Sheets/Panasonic%20Resistors%20Thermistors%20PDFs/ERJ_G,R,E_Rev08.pdf
R10-R27 R37-R54 R62-R75 = R0201 15R: Manufacturer 1: Yageo; Manufacturer Part Number 1: RC0201FR-0715RL; Resistance (Ohms): 15; Tolerance: ±1%; Power (Watts): 0.05W, 1/20W; Temperature Coefficient: ±200ppm/°C; Description 1: RES SMD 15 OHM 1% 1/20W 0201; Category 1: Resistors; Supplier 1: Digi-Key; RoHS: RoHS Compliant; Stock 1: 141540; Pricing 1: 1=0.09, 10=0.047, 25=0.034, 50=0.0258, 100=0.0191, 250=0.01452, 500=0.01164, 1000=0.00855, 5000=0.00613 (EUR); Packaging: Cut Tape (CT); Part Status: Active; Composition: Thick Film; Features: Moisture Resistant; Operating Temperature: -55°C ~ 125°C; Package / Case: 0201 (0603 Metric); Supplier Device Package: 0201; Size / Dimension: 0.024" L x 0.012" W (0.60mm x 0.30mm); Height - Seated (Max): 0.010" (0.26mm); Failure Rate: -; ComponentLink1URL: http://www.yageo.com/documents/recent/PYu-RC_Group_51_RoHS_L_7.pdf; ComponentLink1Description: http://www.yageo.com/documents/recent/PYu-RC_Group_51_RoHS_L_7.pdf

## Sheet [05] - MECHANICAL.SchDoc
size A4; Date: 07/05/2016; CheckedBy: Javier Guillemat; Author: Javier Jiménez; CompanyName: Guilletronic; Organization: Guilletronic; Address1: Calle del Cel Nº14; Address2: Las Colinas; Address3: 08818 Olivella; DocumentNumber: 5; Revision: A; SheetNumber: 5; SheetTotal: 6
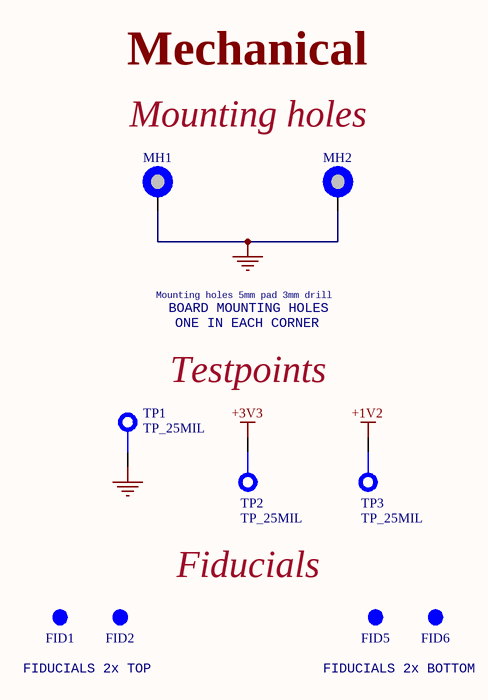
[diagram p5: [05] - MECHANICAL.SchDoc]

### Parts
FID1  FID_40x120  [FID_40x120]  (value not drawn)  (no BOM)
FID2  FID_40x120  [FID_40x120]  (value not drawn)  (no BOM)
FID5  FID_40x120  [FID_40x120]  (value not drawn)  (no BOM)
FID6  FID_40x120  [FID_40x120]  (value not drawn)  (no BOM)
MH1  Mounting Hole  [MH3]  (value not drawn)  (no BOM)
MH2  Mounting Hole  [MH3]  (value not drawn)  (no BOM)
TP1  TP_25MIL  [TP_25MIL]  (no BOM)
TP2  TP_25MIL  [TP_25MIL]  (no BOM)
TP3  TP_25MIL  [TP_25MIL]  (no BOM)

### Nets
+1V2: TP3.1
+3V3: TP2.1
GND: MH1.1 MH2.1 TP1.1

### Notes on the sheet
- Mechanical
- Mounting holes
- Mounting holes 5mm pad 3mm drill
- BOARD MOUNTING HOLES
- ONE IN EACH CORNER
- Testpoints
- Fiducials
- FIDUCIALS 2x TOP
- FIDUCIALS 2x BOTTOM
- Title
- Size:
- Date:
- Created:
- A4
- Number:
- Time:
- Modified:
- Revision:
- Sheet
- of
- Author:
- File:

### Library data of the parts
FID1 FID2 FID5 FID6 = FID_40x120: Fiducial
MH1 MH2 = MH5 Mounting Hole
TP1-TP3 = TP_25MIL: Test Point 25mil

## Nets that join several sheets
+1V2: [03] - CONNECTORS (P4.19 P4.20), [05] - MECHANICAL (TP3.1)
+3V3: [03] - CONNECTORS (6 pins), [04] - RGB LED MATRIX (25 pins), [05] - MECHANICAL (TP2.1)
GND: [03] - CONNECTORS (17 pins), [05] - MECHANICAL (MH1.1 MH2.1 TP1.1)
PIN3: [03] - CONNECTORS (P4.3), [04] - RGB LED MATRIX (R64.2)
PIN4: [03] - CONNECTORS (P4.4), [04] - RGB LED MATRIX (R71.2)
PIN8: [03] - CONNECTORS (P4.6), [04] - RGB LED MATRIX (R57.2)
PIN24: [03] - CONNECTORS (P4.16), [04] - RGB LED MATRIX (R52.2)
PIN25: [03] - CONNECTORS (P4.15), [04] - RGB LED MATRIX (R43.2)
PIN26: [03] - CONNECTORS (P4.18), [04] - RGB LED MATRIX (R38.2)
PIN27: [03] - CONNECTORS (P4.17), [04] - RGB LED MATRIX (R34.2)
PIN28: [03] - CONNECTORS (P4.22), [04] - RGB LED MATRIX (R15.2)
PIN30: [03] - CONNECTORS (P4.21), [04] - RGB LED MATRIX (R47.2)
PIN31: [03] - CONNECTORS (P4.24), [04] - RGB LED MATRIX (R6.2)
PIN32: [03] - CONNECTORS (P4.23), [04] - RGB LED MATRIX (R24.2)
PIN40: [03] - CONNECTORS (P1.1), [04] - RGB LED MATRIX (R19.2)
PIN41: [03] - CONNECTORS (P1.2), [04] - RGB LED MATRIX (R10.2)
PIN42: [03] - CONNECTORS (P1.3), [04] - RGB LED MATRIX (R11.2)
PIN43: [03] - CONNECTORS (P1.4), [04] - RGB LED MATRIX (R1.2)
PIN44: [03] - CONNECTORS (P1.5), [04] - RGB LED MATRIX (R2.2)
PIN45: [03] - CONNECTORS (P1.6), [04] - RGB LED MATRIX (R20.2)
PIN47: [03] - CONNECTORS (P1.7), [04] - RGB LED MATRIX (R25.2)
PIN48: [03] - CONNECTORS (P1.8), [04] - RGB LED MATRIX (R16.2)
PIN51: [03] - CONNECTORS (P1.9), [04] - RGB LED MATRIX (R17.2)
PIN52: [03] - CONNECTORS (P1.10), [04] - RGB LED MATRIX (R7.2)
PIN53: [03] - CONNECTORS (P1.11), [04] - RGB LED MATRIX (R12.2)
PIN55: [03] - CONNECTORS (P1.12), [04] - RGB LED MATRIX (R26.2)
PIN57: [03] - CONNECTORS (P1.13), [04] - RGB LED MATRIX (R3.2)
PIN58: [03] - CONNECTORS (P1.14), [04] - RGB LED MATRIX (R21.2)
PIN59: [03] - CONNECTORS (P1.15), [04] - RGB LED MATRIX (R13.2)
PIN60: [03] - CONNECTORS (P1.16), [04] - RGB LED MATRIX (R8.2)
PIN63: [03] - CONNECTORS (P1.17), [04] - RGB LED MATRIX (R4.2)
PIN64: [03] - CONNECTORS (P1.18), [04] - RGB LED MATRIX (R22.2)
PIN65: [03] - CONNECTORS (P1.19), [04] - RGB LED MATRIX (R27.2)
PIN67: [03] - CONNECTORS (P1.20), [04] - RGB LED MATRIX (R18.2)
PIN69: [03] - CONNECTORS (P1.21), [04] - RGB LED MATRIX (R14.2)
PIN70: [03] - CONNECTORS (P1.22), [04] - RGB LED MATRIX (R9.2)
PIN71: [03] - CONNECTORS (P1.23), [04] - RGB LED MATRIX (R5.2)
PIN72: [03] - CONNECTORS (P1.24), [04] - RGB LED MATRIX (R23.2)
PIN74: [03] - CONNECTORS (P2.4), [04] - RGB LED MATRIX (R37.2)
PIN75: [03] - CONNECTORS (P2.5), [04] - RGB LED MATRIX (R46.2)
PIN76: [03] - CONNECTORS (P2.6), [04] - RGB LED MATRIX (R28.2)
PIN79: [03] - CONNECTORS (P2.7), [04] - RGB LED MATRIX (R51.2)
PIN80: [03] - CONNECTORS (P2.8), [04] - RGB LED MATRIX (R42.2)
PIN81: [03] - CONNECTORS (P2.9), [04] - RGB LED MATRIX (R63.2)
PIN86: [03] - CONNECTORS (P2.10), [04] - RGB LED MATRIX (R33.2)
PIN87: [03] - CONNECTORS (P2.11), [04] - RGB LED MATRIX (R70.2)
PIN92: [03] - CONNECTORS (P2.16), [04] - RGB LED MATRIX (R56.2)
PIN93: [03] - CONNECTORS (P2.17), [04] - RGB LED MATRIX (R75.2)
PIN94: [03] - CONNECTORS (P2.18), [04] - RGB LED MATRIX (R68.2)
PIN96: [03] - CONNECTORS (P2.19), [04] - RGB LED MATRIX (R41.2)
PIN97: [03] - CONNECTORS (P2.20), [04] - RGB LED MATRIX (R61.2)
PIN99: [03] - CONNECTORS (P2.21), [04] - RGB LED MATRIX (R32.2)
PIN100: [03] - CONNECTORS (P2.22), [04] - RGB LED MATRIX (R50.2)
PIN101: [03] - CONNECTORS (P2.23), [04] - RGB LED MATRIX (R69.2)
PIN103: [03] - CONNECTORS (P2.24), [04] - RGB LED MATRIX (R62.2)
PIN104: [03] - CONNECTORS (P2.25), [04] - RGB LED MATRIX (R55.2)
PIN112: [03] - CONNECTORS (P3.3), [04] - RGB LED MATRIX (R60.2)
PIN113: [03] - CONNECTORS (P3.4), [04] - RGB LED MATRIX (R74.2)
PIN114: [03] - CONNECTORS (P3.5), [04] - RGB LED MATRIX (R45.2)
PIN115: [03] - CONNECTORS (P3.6), [04] - RGB LED MATRIX (R67.2)
PIN118: [03] - CONNECTORS (P3.7), [04] - RGB LED MATRIX (R36.2)
PIN119: [03] - CONNECTORS (P3.8), [04] - RGB LED MATRIX (R54.2)
PIN120: [03] - CONNECTORS (P3.9), [04] - RGB LED MATRIX (R73.2)
PIN121: [03] - CONNECTORS (P3.10), [04] - RGB LED MATRIX (R66.2)
PIN122: [03] - CONNECTORS (P3.11), [04] - RGB LED MATRIX (R40.2)
PIN125: [03] - CONNECTORS (P3.12), [04] - RGB LED MATRIX (R59.2)
PIN126: [03] - CONNECTORS (P3.13), [04] - RGB LED MATRIX (R31.2)
PIN129: [03] - CONNECTORS (P3.14), [04] - RGB LED MATRIX (R49.2)
PIN132: [03] - CONNECTORS (P3.15), [04] - RGB LED MATRIX (R72.2)
PIN133: [03] - CONNECTORS (P3.16), [04] - RGB LED MATRIX (R65.2)
PIN134: [03] - CONNECTORS (P3.17), [04] - RGB LED MATRIX (R44.2)
PIN135: [03] - CONNECTORS (P3.18), [04] - RGB LED MATRIX (R58.2)
PIN136: [03] - CONNECTORS (P3.19), [04] - RGB LED MATRIX (R35.2)
PIN137: [03] - CONNECTORS (P3.20), [04] - RGB LED MATRIX (R53.2)
PIN139: [03] - CONNECTORS (P3.21), [04] - RGB LED MATRIX (R48.2)
PIN141: [03] - CONNECTORS (P3.22), [04] - RGB LED MATRIX (R39.2)
PIN142: [03] - CONNECTORS (P3.23), [04] - RGB LED MATRIX (R29.2)
PIN143: [03] - CONNECTORS (P3.24), [04] - RGB LED MATRIX (R30.2)